# EAGLE design at90usb (EAGLE 7.5.0)
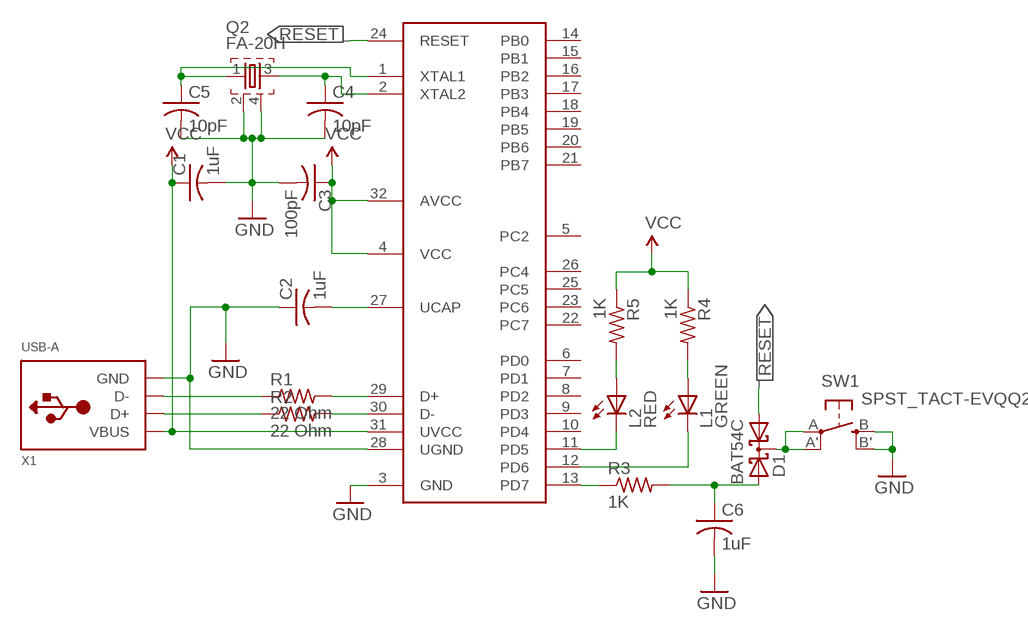
[diagram p0: schematic, sheet 1]

## Parts
C1  1uF  C-USC0805K  [C0805K]
C2  1uF  C-USC0805K  [C0805K]
C3  100pF  C-USC0805K  [C0805K]
C4  10pF  C-USC0805  [C0805]
C5  10pF  C-USC0805  [C0805]
C6  1uF  C-USC0805K  [C0805K]
D1  BAT54C  [SOT23]
L1  GREEN  LEDCHIPLED_1206  [CHIPLED_1206]
L2  RED  LEDCHIPLED_1206  [CHIPLED_1206]
Q2  FA-20H  [FA-20H]
R1  22 Ohm  R-US_M0805  [M0805]
R2  22 Ohm  R-US_M0805  [M0805]
R3  1K  R-US_M0805  [M0805]
R4  1K  R-US_M0805  [M0805]
R5  1K  R-US_M0805  [M0805]
SW1  SPST_TACT-EVQQ2  [EVQ-Q2]
U1  AT90USB162  [VQFP32]
X1  USB-A  [MOLEX_480371000]

## Nets
GND: C1.2 C2.1 C3.2 C4.2 C5.2 C6.2 Q2.2 Q2.4 SW1.B'(S1) SW1.B(S) U1.3(GND) U1.28(UGND) X1.4(GND)
N$1: R1.2 U1.29(D+)
N$2: R2.2 U1.30(D-)
N$3: R1.1 X1.2(D-)
N$4: R2.1 X1.3(D+)
N$5: D1.3(CC) SW1.A'(P1) SW1.A(P)
N$6: C5.1 Q2.1 U1.1(XTAL1)
N$7: C2.2 U1.27(UCAP)
N$8: C4.1 Q2.3 U1.2(XTAL2)
N$9: C6.1 D1.2(A2) R3.2
N$10: R3.1 U1.13(PD7)
N$11: L1.C U1.12(PD6)
N$12: L1.A R4.2
N$14: L2.C U1.11(PD5)
N$15: L2.A R5.2
RESET: D1.1(A1) U1.24(RESET)
VCC: C1.1 C3.1 R4.1 R5.1 U1.4(VCC) U1.31(UVCC) U1.32(AVCC) X1.1(VBUS)
Unconnected: U1.5(PC2) U1.6(PD0) U1.7(PD1) U1.8(PD2) U1.9(PD3) U1.10(PD4) U1.14(PB0) U1.15(PB1) U1.16(PB2) U1.17(PB3) U1.18(PB4) U1.19(PB5) U1.20(PB6) U1.21(PB7) U1.22(PC7) U1.23(PC6) U1.25(PC5) U1.26(PC4)

## Library data of the parts
C1 C2 C6 = rcl:C-US: CAPACITOR, American symbol; MPN: 06033D105MAT2A; OC_NEWARK: 50R8324
C3 = rcl:C-US: CAPACITOR, American symbol; MPN: 0603YC104K4Z2A; OC_NEWARK: 26M5119
C4 C5 = rcl:C-US: CAPACITOR, American symbol; OC_NEWARK: unknown
D1 = diode:BAT54C: Schottky Diodes Source: Fairchild .. BAT54.pdf; OC_NEWARK: unknown
L1 L2 = adafruit:LED: LED OSRAM: - CHIPLED LG R971, LG N971, LY N971, LG Q971, LY Q971, LO R971, LY R971 LH N974, LH R974 LS Q976, LO Q976, LY Q976 LO Q996 - Hyper CHIPLED LW Q18S LB Q993, LB Q99A, LB R99A - SideLED LS A670, LO A670, LY A670, LG A670, LP A670 LB A673, LV A673, LT A673, LW A673 LH A674 LY A675 LS A676, LA A676, LO A676, LY A676, LW A676 LS A679, LY A679, LG A679 - Hyper Micro SIDELED® LS Y876, LA Y876, LO Y876, LY Y876 LT Y87S - SmartLED LW L88C, LW L88S LB L89C, LB L89S, LG L890 LS L89K, LO L89K, LY L89K LS L896, LA L896, LO L896, LY L896 - TOPLED LS T670, LO T670, LY T670, LG T670, LP T670 LSG T670, LSP T670, LSY T670, LOP T670, LYG T670 LG T671, LOG T671, LSG T671 LB T673, LV T673, LT T673, LW T673 LH T674 LS T676, LA T676, LO T676, LY T676, LB T676, LH T676, LSB T676, LW T676 LB T67C, LV T67C, LT T67C, LS T67K, LO T67K, LY T67K, LW E67C LS E67B, LA E67B, LO E67B, LY E67B, LB E67C, LV E67C, LT E67C LW T67C LS T679, LY T679, LG T679 LS T770, LO T770, LY T770, LG T770, LP T770 LB T773, LV T773, LT T773, LW T773 LH T774 LS E675, LA E675, LY E675, LS T675 LS T776, LA T776, LO T776, LY T776, LB T776 LHGB T686 LT T68C, LB T68C - Hyper Mini TOPLED® LB M676 - Mini TOPLED Santana® LG M470 LS M47K, LO M47K, LY M47K Source: http://www.osram.convergy.de/
Q2 = crystal:FA-: MHz RANGE CRYSTAL UNIT Source: Epson Toyocom
R1-R5 = rcl:R-US_: RESISTOR, American symbol; OC_NEWARK: unknown
SW1 = adafruit:SPST_TACT: SMT 6mm switch, EVQQ2 series http://www.ladyada.net/library/eagle; OC_NEWARK: unknown
U1 = at90usb:AT90USB162; OC_NEWARK: unknown
X1 = adafruit:USB-A: USB type A 'plug' Used for things that can directly connect to a USB port, say USB key; OC_NEWARK: unknown

## Net classes
0 default: width 0.254 mm, clearance 0.254 mm

## Board
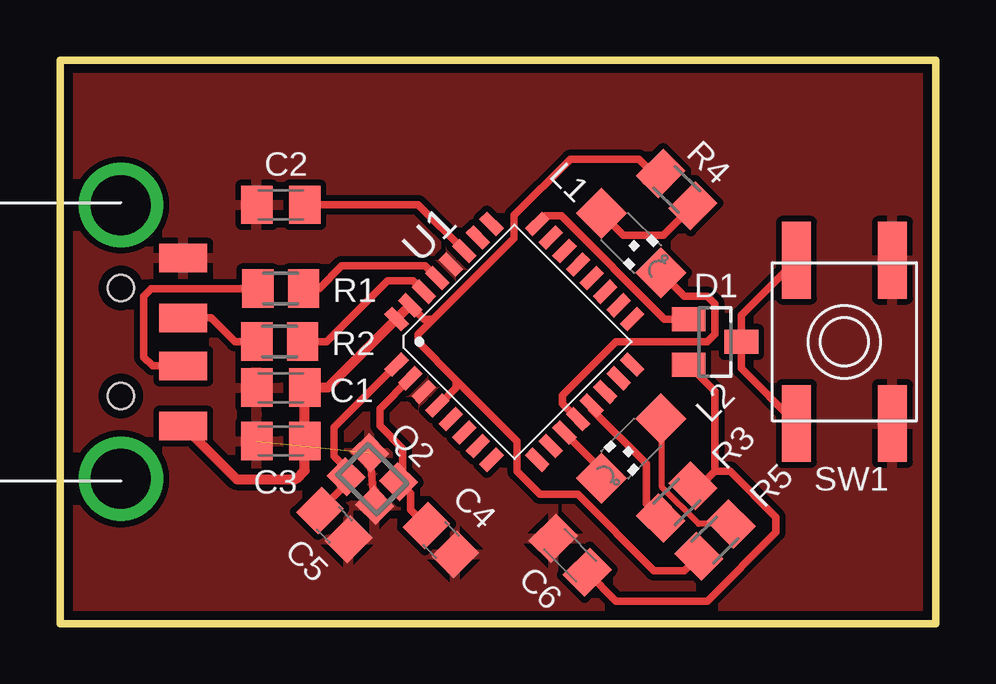
[diagram p1: board, top side]

Size 36.51 x 23.49 mm. Coordinates in mm from the lower left corner, seen from the top.
Outline: 0,23.49 36.51,23.49 36.51,0 0,0 0,23.49
Copper layers (1*16): Top 0.0356mm / dielectric 1.5011mm / Bottom 0.0356mm
Design rules "LaenPCBOrder": minimum track width 6mil, minimum drill 13mil, track to track 6mil, track to pad 6mil, pad to pad 6mil, via to via 6mil, smd to smd 6mil, copper to edge 15mil, drill to drill 6mil, minimum pad ring 7mil, minimum via ring 7mil, stop-mask expansion 3mil, vias tented up to drill 0mil, thermal gap 10mil

### Footprints (pad centres in the part's own frame; a part is rotated, then mirrored left to right if it is on the bottom)
C0805K = smd 1.3 x 1.6: 1 -1,0; 2 1,0
C0805 = smd 1.3 x 1.5: 1 -0.85,0; 2 0.85,0
SOT23 = smd 1 x 1.4: 1 -0.95,-1.1; 2 0.95,-1.1; 3 0,1.1
CHIPLED_1206 = smd 1.5 x 1.5: A 0,-1.75; C 0,1.75
FA-20H = smd 1.2 x 1.1: 1 -0.85,-0.7; 2 0.85,-0.7; 3 0.85,0.7; 4 -0.85,0.7
M0805 = smd 1.3 x 1.6: 1 -0.95,0; 2 0.95,0
EVQ-Q2 = smd 3.2 x 1.2: A -3.4,-2; A' 3.4,-2; B -3.4,2; B' 3.4,2
VQFP32 = smd 1 x 0.45: 1 -4.15,2.8; 2 -4.15,2; 3 -4.15,1.2; 4 -4.15,0.4; 5 -4.15,-0.4; 6 -4.15,-1.2; 7 -4.15,-2; 8 -4.15,-2.8; 17 4.15,-2.8; 18 4.15,-2; 19 4.15,-1.2; 20 4.15,-0.4; 21 4.15,0.4; 22 4.15,1.2; 23 4.15,2; 24 4.15,2.8 | smd 0.45 x 1: 9 -2.8,-4.15; 10 -2,-4.15; 11 -1.2,-4.15; 12 -0.4,-4.15; 13 0.4,-4.15; 14 1.2,-4.15; 15 2,-4.15; 16 2.8,-4.15; 25 2.8,4.15; 26 2,4.15; 27 1.2,4.15; 28 0.4,4.15; 29 -0.4,4.15; 30 -1.2,4.15; 31 -2,4.15; 32 -2.8,4.15
MOLEX_480371000 = smd 1.2 x 2: 1 3.5,2.6; 2 1,2.6; 3 -1,2.6; 4 -3.5,2.6 | drill 2.5: M1 -5.7,0; M2 5.7,0 | hole 1.1: -2.25,0; 2.25,0

### Placement (x,y rotation side)
C1  9.21,9.84 180 top
C2  9.21,17.46 0 top
C3  9.21,7.62 180 top
C4  15.87,3.49 315 top
C5  11.43,4.13 315 top
C6  21.27,2.86 135 top
D1  27.31,11.75 270 top
L1  23.81,15.88 225 top
L2  23.81,7.3 135 top
Q2  13.02,6.03 315 top
R1  9.2,13.97 0 top
R2  9.16,11.76 0 top
R3  25.72,5.08 45 top
R4  25.72,18.1 315 top
R5  27.31,3.49 45 top
SW1  32.7,11.75 270 top
U1  18.94,11.76 45 top
X1  2.54,11.75 270 top

### Tracks (layer width: path | path; a pad name or v marks a point on that pad's centre or on a via)
GND  (1 unrouted)
  Top 0.305: Q2.4 Q2.2
  pour Top: 0,23.49 0,0 36.83,0 36.51,23.49
N$1
  Top 0.305: U1.29 15.21,14.92 11.75,14.92 10.8,13.97 R1.2
N$2
  Top 0.305: U1.30 14.72,14.29 13.65,14.29 11.12,11.76 R2.2
N$3
  Top 0.305: X1.2 3.86,10.75 3.49,11.11 3.49,13.65 3.81,13.97 R1.1 | R1.1
N$4
  Top 0.305: X1.3 6.3,12.75 7.3,11.75 8.2,11.75 R2.1
N$5
  Top 0.305: SW1.A 28.4,12.85 D1.3 28.4,10.65 SW1.A'
N$6
  Top 0.305: C5.1 11.92,5.82 Q2.1 11.92,6.49 11.43,6.99 11.43,8.2 U1.1
N$7
  Top 0.305: C2.2 14.93,17.46 U1.27
N$8
  Top 0.305: C4.1 14.61,4.76 14.61,5.44 Q2.3 14.29,6.1 14.29,7.3 13.34,8.26 13.34,8.97 U1.2
N$9
  Top 0.305: C6.1 23.18,0.95 26.99,0.95 29.85,3.81 29.85,4.45 27.94,6.35 27.31,6.35 | 27.31,6.35 26.71,5.75 R3.2 | D1.2 27.31,9.7 27.31,6.35
N$10
  Top 0.305: R3.1 24.45,5.01 24.45,6.67 22.16,8.95 U1.13
N$11
  Top 0.305: U1.12 20.96,9.18 20.96,9.53 23.18,11.75 26.99,11.75 27.31,12.06 27.31,13.33 26.99,13.65 26.03,13.65 L1.C
N$12
  Top 0.305: R4.2 25.16,16.19 23.5,16.19 L1.A
N$14
  Top 0.305: L2.C 22.58,6.43 U1.11
N$15
  Top 0.254: R5.2 26.63,4.16 25.08,5.71 25.08,8.51 L2.A
RESET
  Top 0.305: D1.1 25.2,12.7 20.9,17 20.23,17 U1.24
VCC
  Top 0.305: U1.31 15.17,12.7 15.56,12.7 | 24.41,18.45 R4.1 | 15.56,12.7 14.92,12.06 14.92,11.75 16.51,10.16 | 16.51,10.16 16.51,9.84 15.77,9.1 U1.4 | 24.76,19.05 R4.1 | R5.1 26.04,2.22 24.76,2.22 21.59,5.4 20,5.4 19.05,6.35 19.05,7.62 16.51,10.16 | R4.1 24.73,18.77 24.13,19.37 21.27,19.37 18.93,17.03 18.93,16.07 15.56,12.7
  Top 0.406: X1.1 7.36,6.03 9.84,6.03 10.21,6.4 C3.1 C1.1 11.16,9.84 U1.32 U1.31